# Altium schematic sheet GSM.SchDoc
size A4
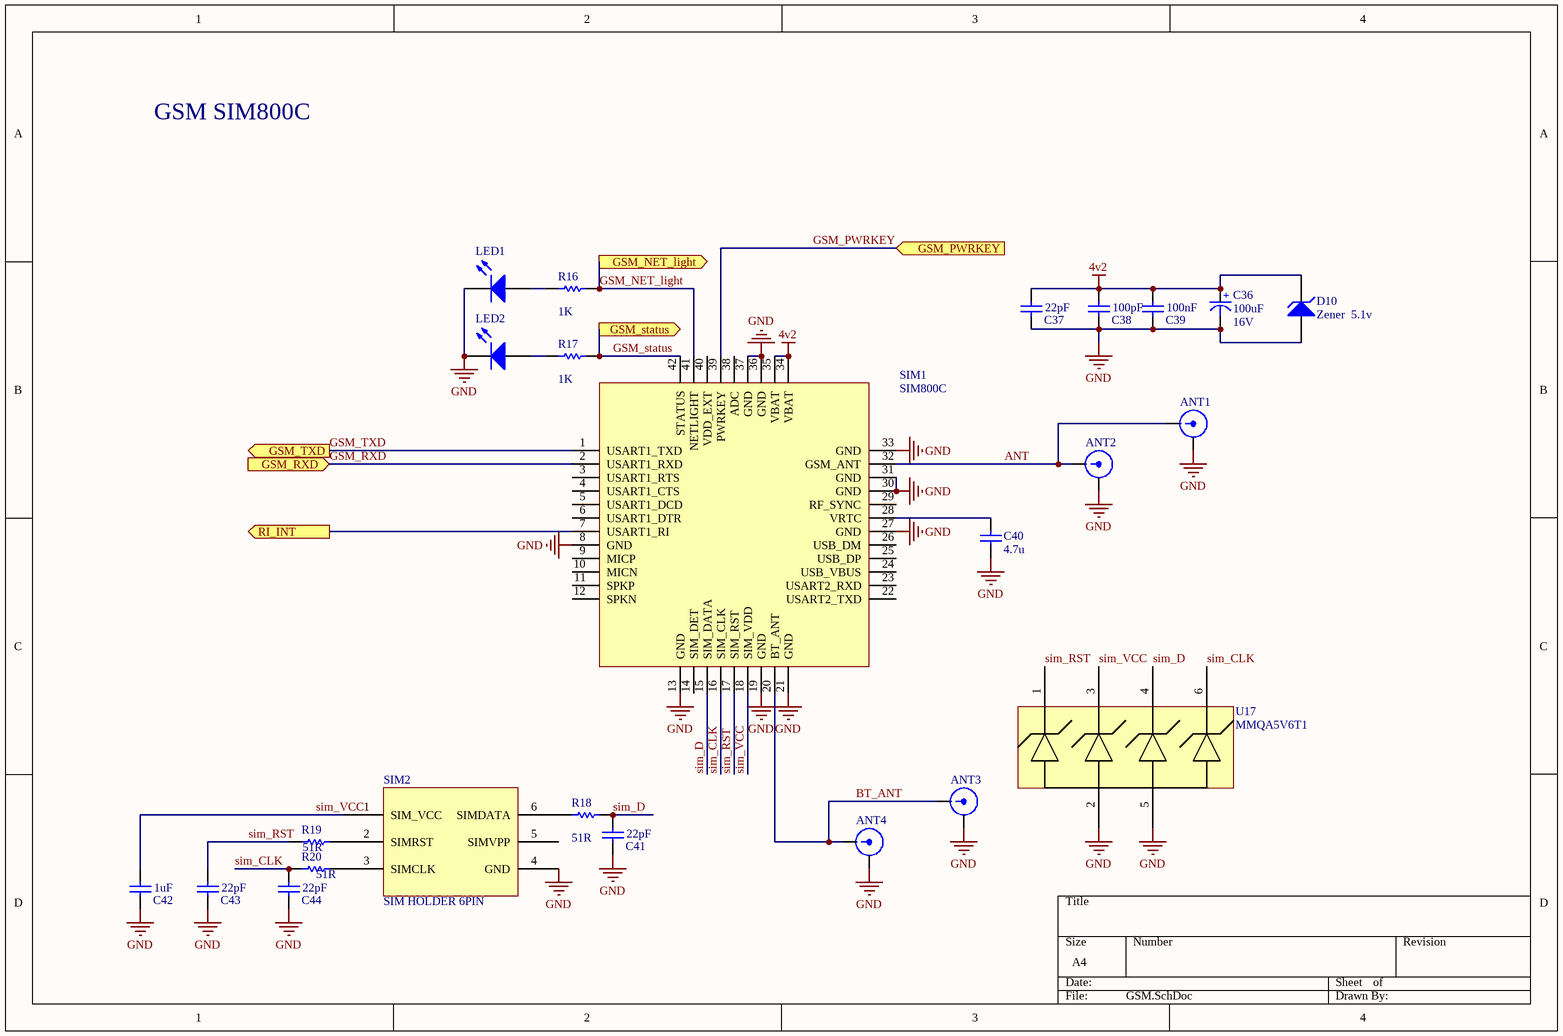
[diagram p0: GSM.SchDoc]

## Parts
ANT1  Antenna UFL  [UFL ant]  (value not drawn)
ANT2  Antenna SMA  [SMA]  (value not drawn)
ANT3  Antenna UFL  [UFL ant]  (value not drawn)
ANT4  Antenna SMA  [SMA]  (value not drawn)
C36  value 100uF  Voltage: 16V  [Cap 1206 (3216X18L) Size A]  (hidden comment: cap 100uF)
C37  value 22pF  [Cap 805]  (hidden comment: cap 22pF)
C38  value 100pF  [Cap 805]  (hidden comment: cap 100pF)
C39  value 100nF  [Cap 805]  (hidden comment: cap 100nF)
C40  value 4.7u  [Cap 805]  (hidden comment: cap 4.7u)
C41  value 22pF  [Cap 805]  (hidden comment: cap 22pF)
C42  value 1uF  [Cap 805]  (hidden comment: cap 1uF)
C43  value 22pF  [Cap 805]  (hidden comment: cap 22pF)
C44  value 22pF  [Cap 805]  (hidden comment: cap 22pF)
D10  Zener  5.1v  [Diode 1n4148 SMD]
LED1  LED Green  [0805-LED]  (value not drawn)
LED2  LED Red  [0805-LED]  (value not drawn)
R16  value 1K  [RES 0805 (2012X06L)]  (hidden comment: Res 1K)
R17  value 1K  [RES 0805 (2012X06L)]  (hidden comment: Res 1K)
R18  value 51R  [RES 0805 (2012X06L)]  (hidden comment: Res 51R)
R19  value 51R  [RES 0805 (2012X06L)]  (hidden comment: Res 51R)
R20  value 51R  [RES 0805 (2012X06L)]  (hidden comment: Res 51R)
SIM1  SIM800C  [SIM800C]
SIM2  SIM HOLDER 6PIN  [simcard_holder]
U17  MMQA5V6T1  [SOT23-6]

## Ports
GSM_NET_light (out), GSM_PWRKEY (in), GSM_RXD (in), GSM_status (out), GSM_TXD (out), RI_INT (out)

## Nets
4v2: C36.1(+) C37.2 C38.2 C39.2 D10.2(K) SIM1.34(VBAT) SIM1.35(VBAT)
GND: ANT1.2 ANT2.2 ANT3.2 ANT4.2 C36.2(-) C37.1 C38.1 C39.1 C40.1 C41.1 C42.1 C43.1 C44.1 D10.1(A) LED1.K LED2.K SIM1.8(GND) SIM1.13(GND) SIM1.19(GND) SIM1.21(GND) SIM1.27(GND) SIM1.30(GND) SIM1.31(GND) SIM1.33(GND) SIM1.36(GND) SIM1.37(GND) SIM2.4(GND) U17.2(Cathode) U17.5(Cathode)
ANT: ANT1.1 ANT2.1 SIM1.32(GSM_ANT)
BT_ANT: ANT3.1 ANT4.1 SIM1.20(BT_ANT)
GSM_NET_light: R16.1 SIM1.41(NETLIGHT) ; port GSM_NET_light
GSM_PWRKEY: SIM1.39(PWRKEY) ; port GSM_PWRKEY
GSM_RXD: SIM1.2(USART1_RXD) ; port GSM_RXD
GSM_status: R17.1 SIM1.42(STATUS) ; port GSM_status
GSM_TXD: SIM1.1(USART1_TXD) ; port GSM_TXD
RI_INT: SIM1.7(USART1_RI) ; port RI_INT
sim_CLK: C44.2 R20.1 SIM1.16(SIM_CLK) U17.6(Cathode)
sim_D: C41.2 R18.2 SIM1.15(SIM_DATA) U17.4(Cathode)
sim_RST: C43.2 R19.1 SIM1.17(SIM_RST) U17.1(Cathode)
sim_VCC: C42.2 SIM1.18(SIM_VDD) SIM2.1(SIM_VCC) U17.3(Cathode)
NetC40_2: C40.2 SIM1.28(VRTC)
NetLED1_A: LED1.A R16.2
NetLED2_A: LED2.A R17.2
NetR18_1: R18.1 SIM2.6(SIMDATA)
NetR19_2: R19.2 SIM2.2(SIMRST)
NetR20_2: R20.2 SIM2.3(SIMCLK)

Not connected (* = marked no-connect by the designer): SIM1 3(USART1_RTS) 4(USART1_CTS) 5(USART1_DCD) 6(USART1_DTR) 9(MICP) 10(MICN) 11(SPKP) 12(SPKN) 14(SIM_DET) 22(USART2_TXD) 23(USART2_RXD) 24(USB_VBUS) 25(USB_DP) 26(USB_DM) 29(RF_SYNC) 38(ADC) 40(VDD_EXT); SIM2 5(SIMVPP)

## Notes on the sheet
- GSM SIM800C

## Library data of the parts
ANT1 ANT3 = ANT SMA: Antenna; pin to pad: 1>S 2>G; Designer: Ali Hafizi
ANT2 ANT4 = ANT SMA: Antenna; Designer: Ali Hafizi
C36 = Cap-Polar: Tantal Capacitor Size A; Designer: Saeid Jorablo; Organazation: ControTec; Adding Date: 1387/12/20
C37-C44 = Cap ceramic: Capacitor
D10 = D Zener: Zener Diode; Published: 8-Jun-2000; LatestRevisionDate: 17-Jul-2002; LatestRevisionNote: Re-released for DXP Platform.; PackageReference: DIODE-0.7; Publisher: Altium Limited; PackageDescription: Diode, Thru-Hole; 2 Leads; 0.7 in Pin Spacing
LED1 LED2 = LED: LED SMD; pin to pad: K>C; Published: 8-Jun-2000; LatestRevisionDate: 08-Jul-2005; LatestRevisionNote: Mech Layer 1 removed.; Publisher: Altium Limited
R16-R20 = Res1: Resistor; Published: 8-Jun-2000; LatestRevisionDate: 17-Jul-2002; LatestRevisionNote: Re-released for DXP Platform.; PackageReference: AXIAL-0.3; Publisher: Altium Limited; PackageDescription: Axial Device, Thru-Hole; 2 Leads; 0.3 in Pin Spacing
SIM1 = SIM800C: GSM Module; Designer: Ali Hafizi
SIM2 = SIM HOLDER: Deigner: Ali Hafizi
U17 = MMQA5V6T1: TVS diode ESD protection